# Altium schematic sheet DDR3 SODIMM SPD Breakout.SchDoc
size A
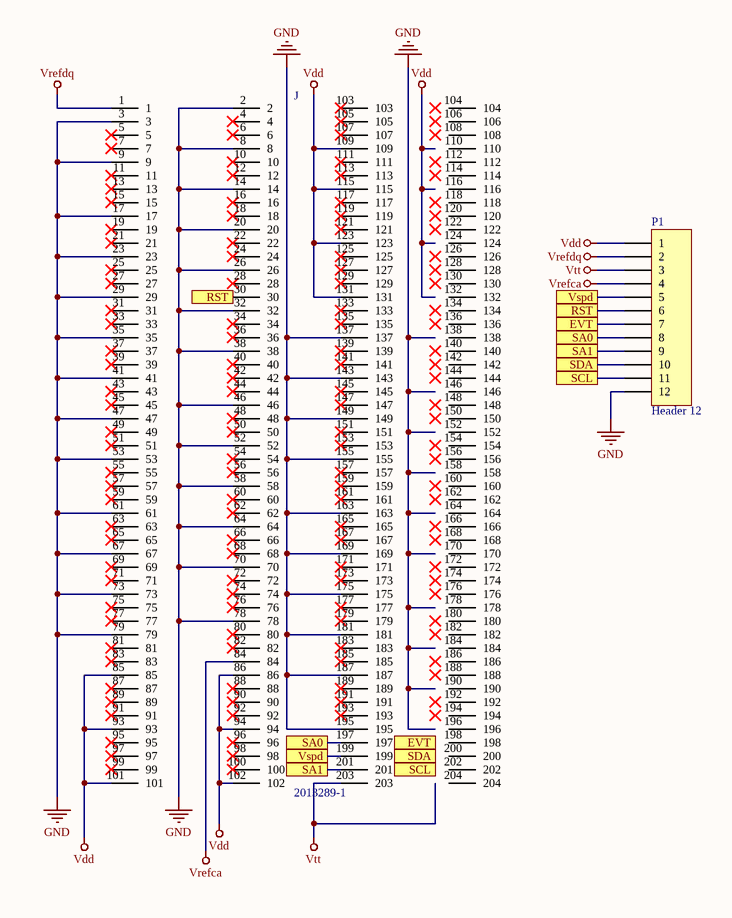
[diagram p0: DDR3 SODIMM SPD Breakout.SchDoc]

## Parts
J  2013289-1  [TE_2013289-1]
P1  Header 12  [HDR1X12]

## Ports
EVT, RST, SA0, SA1, SCL, SDA, Vspd

## Nets
GND: J.2 J.3 J.8 J.9 J.14 J.17 J.20 J.23 J.26 J.29 J.32 J.35 J.38 J.41 J.46 J.47 J.52 J.53 J.58 J.61 J.64 J.67 J.70 J.73 J.78 J.79 J.137 J.143 J.149 J.155 J.163 J.169 J.175 J.181 J.187 J.195 P1.12
Vdd: J.85 J.86 J.93 J.94 J.101 J.102 J.109 J.115 J.123 J.131 P1.1
Vrefca: J.84 P1.4
Vrefdq: J.1 P1.2
Vtt: J.203 P1.3
EVT: P1.7 ; port EVT
RST: J.30 P1.6 ; port RST
SA0: J.197 P1.8 ; port SA0
SA1: J.201 P1.9 ; port SA1
SCL: P1.11 ; port SCL
SDA: P1.10 ; port SDA
Vspd: J.199 P1.5 ; port Vspd

Not connected (* = marked no-connect by the designer): J 4* 5* 6* 7* 10* 11* 12* 13* 15* 16* 18* 19* 21* 22* 24* 25* 27* 28* 31* 33* 34* 36* 37* 39* 40* 42* 43* 44* 45* 48* 49* 50* 51* 54* 55* 56* 57* 59* 60* 62* 63* 65* 66* 68* 69* 71* 72* 74* 75* 76* 77* 80* 81* 82* 83* 87* 88* 89* 90* 91* 92* 95* 96* 97* 98* 99* 100* 103* 104 105* 106 107* 108 110 111* 112 113* 114 116 117* 118 119* 120 121* 122 124 125* 126 127* 128 129* 130 132 133* 134 135* 136 138 139* 140 141* 142 144 145* 146 147* 148 150 151* 152 153* 154 156 157* 158 159* 160 161* 162 164 165* 166 167* 168 170 171* 172 173* 174 176 177* 178 179* 180 182 183* 184 185* 186 188 189* 190 191* 192 193* 194 196 198 200 202 204

## Library data of the parts
J = 2013289-1: 204 Position 0.6 mm Pitch Right Angle Surface Mount Socket DIMM Connector; Number_of_Positions: 204; MF: TE Connectivity; Centerline_Pitch: .6 mm[.024 in]; Product_Type: Socket; Package: None; Digi-Key_Purchase_URL: https://www.digikey.com/product-detail/en/te-connectivity-amp-connectors/2013289-1/A115021-ND/2135546?utm_source=snapeda&utm_medium=aggregator&utm_campaign=symbol; Digi-Key_Part_Number: A115021-ND; SnapEDA_Link: https://www.snapeda.com/parts/2013289-1/TE%20Connectivity%20AMP%20Connectors/view-part/231016/?ref=snap; MP: 2013289-1; TE_purchase_URL: https://www.te.com/usa-en/product-2013289-1.html?te_bu=Cor&te_type=disp&te_campaign=seda_glo_cor-seda-global-disp-prtnr-fy19-seda-model-bom-cta_sma-317_1&elqCampaignId=32493; Value: *
P1 = Header 12: Header, 12-Pin; LatestRevisionDate: 17-Jul-2002; LatestRevisionNote: Re-released for DXP Platform.; Publisher: Altium Limited